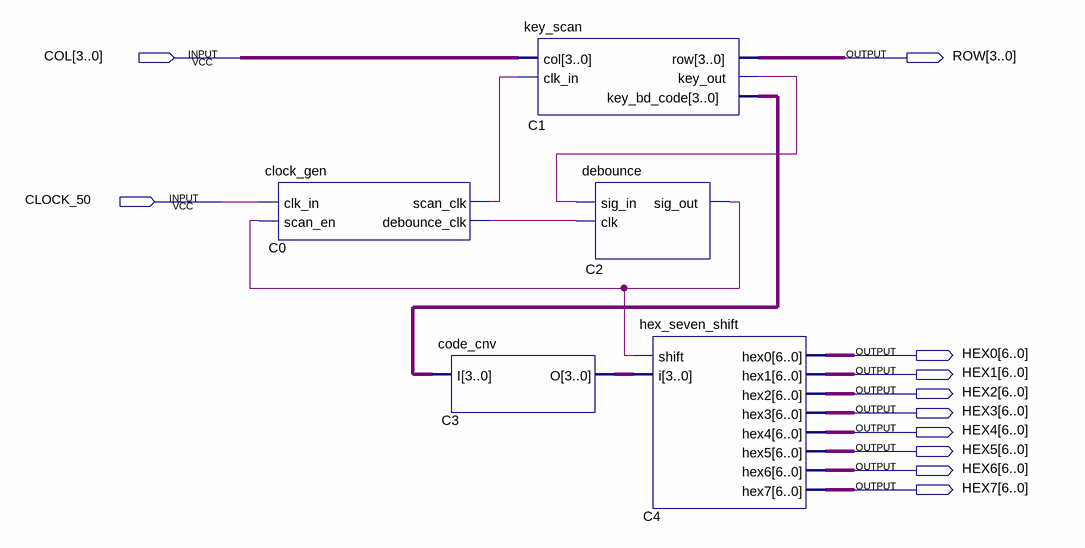
[diagram p0: schematic sheet]
// Quartus schematic lab3.bdf as structural Verilog: 5 symbols, 11 pins
module lab3 (
  input  [3:0] COL,
  input  CLOCK_50,
  output [3:0] ROW,
  output [6:0] HEX0,
  output [6:0] HEX1,
  output [6:0] HEX2,
  output [6:0] HEX3,
  output [6:0] HEX4,
  output [6:0] HEX5,
  output [6:0] HEX6,
  output [6:0] HEX7
);

  wire C0_debounce_clk, C0_scan_clk, C1_key_out, C2_sig_out;
  wire [3:0] C1_key_bd_code, C3_o;

  clock_gen C0 (.clk_in(CLOCK_50), .scan_en(C2_sig_out), .scan_clk(C0_scan_clk), .debounce_clk(C0_debounce_clk));
  code_cnv C3 (.I(C1_key_bd_code), .O(C3_o));
  key_scan C1 (.col(COL), .clk_in(C0_scan_clk), .row(ROW), .key_out(C1_key_out), .key_bd_code(C1_key_bd_code));
  debounce C2 (.sig_in(C1_key_out), .clk(C0_debounce_clk), .sig_out(C2_sig_out));
  hex_seven_shift C4 (
    .shift(C2_sig_out), .i(C3_o), .hex0(HEX0), .hex1(HEX1), .hex2(HEX2), .hex3(HEX3), .hex4(HEX4),
    .hex5(HEX5), .hex6(HEX6), .hex7(HEX7));
endmodule
